# Altium schematic sheet Out.SchDoc: Sheetname
size A4; Date: 05.10.2017; CheckedBy: UNCHECKED; Author: Team Member; Organization: Baltic Racing; Address1: Zur Schwedenschanze 15; Address2: Haus 18; Address3: 18435 Stralsund; Revision: xx.xx; SheetNumber: 8; SheetTotal: 8; Rules: TODO; ProjectName: Projekt
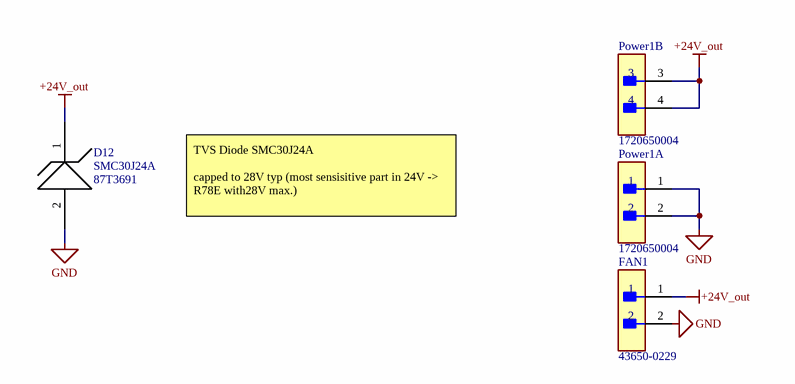
[diagram p0: Out.SchDoc]

## Parts
D12  SMC30J24A  Supplier Part Number 1: 87T3691  [JEDEC DO-214AB]
FAN1  43650-0229  [FP-43650-0229-MFG]
Power1  1720650004  [FP-1720650004-MFG]  (parts A,B of 2)

## Nets
+24V_out: D12.1 FAN1.1 Power1.3 Power1.4
GND: D12.2 FAN1.2 Power1.1 Power1.2

## Notes on the sheet
- TVS Diode SMC30J24A
  capped to 28V typ (most sensisitive part in 24V -> R78E with28V max.)
- Title:
- Projekt:
- Revision:
- Author:
- Rules:
- Checked by:
- Sheet
- of
- Size:
- A4
- Date:
- Time:

## Library data of the parts
D12 = SMC30J24A: 3000 W TVS in SMC package; Manufacturer: STMicroelectronics; Direction: Unidirectional; Number of Unidirectional Channels: 1; Reverse Standoff Voltage: 24V; Min Breakdown Voltage: 26.7V; Clamping Voltage: 38.9V; Peak Pulse Power: 3kW; Power Line Protection: No; Peak Pulse Current: 77A; Diode Type: ZENER; Supplier 1: Newark; Manufacturer Part Number: SMC30J24A; RoHS: Yes; Category: Diodes; Pricing 1: 2500=0,61100 (USD); Mount: Surface Mount; Case/Package: SMC; Number of Pins: 2; Min Operating Temperature: -55°C; Max Operating Temperature: 175°C; Packaging: Tape and Reel; Package Quantity: 2500; Polarity: Unidirectional; Working Voltage: 24V; Max Power Dissipation: 3kW; Breakdown Voltage: 26.7V; Resistor Type: Zener; Series: SMC30J, TRANSIL™; Radiation Hardening: No; REACH SVHC: No SVHC; Lead Free: Lead Free; RoHS Compliant: Yes; ComponentLink1URL: https://datasheet.ciiva.com/339/dm00035134-339433.pdf?src-supplier=Digi-Key; ComponentLink1Description: https://datasheet.ciiva.com/339/dm00035134-339433.pdf?src-supplier=Digi-Key; ComponentLink2URL: https://datasheet.ciiva.com/339/dm00035134-339434.pdf?src-supplier=Digi-Key; ComponentLink2Description: https://datasheet.ciiva.com/339/dm00035134-339434.pdf?src-supplier=Digi-Key; ComponentLink3URL: https://datasheet.ciiva.com/339/dm00035134-339435.pdf?src-supplier=Digi-Key; ComponentLink3Description: https://datasheet.ciiva.com/339/dm00035134-339435.pdf?src-supplier=Digi-Key
FAN1 = CMP-04776-000041-1: CONN HEADER VERT 2POS 3MM; Manufacturer: Molex; Voltage Rating: 600V; Conn Orientation: Vertical; Conn Gender: Male; Number Of Contacts: 2; Current Rating: 8.5A; ComponentLink2URL: https://www.molex.com/webdocs/datasheets/pdf/en-us/0436500229_PCB_HEADERS.pdf; ComponentLink2Description: Datasheet; Mouser Description: Headers & Wire Housings MicroFit 3.0 SR V TH Peg 30Au 2Ckt; Category: Conn; Height: 10.15mm; Contact Material: Gold,Nickel; Octopart: https://octopart.com/43650-0229-molex-7652326; Manufacturer Part Number: 43650-0229; Device Class L3: unset; Digikey Description: CONN HEADER VERT 2POS 3MM; Temperature Range Low: -40°C; Temperature Range High: +105°C; Pitch: 3mm; Package: 0; RoHS: TRUE; Device Class L1: Connectors; Lead Free: Yes; Temperature: -40°C to +105°C; Number Of Rows: 1; Automotive: No; Device Class L2: Headers and Wire Housings; Footprint Url: https://www.molex.com/pdm_docs/sd/436500229_sd.pdf
Power1 = CMP-04776-000102-1: CONN HEADER VERT 4POS 5.7MM; Manufacturer: Molex; Conn Orientation: Vertical; Conn Gender: Male; Voltage Rating: 600V; Number Of Contacts: 4; Current Rating: 23A; Footprint Url: https://www.molex.com/pdm_docs/sd/1720650004_sd.pdf; RoHS: TRUE; Mouser Description: Headers & Wire Housings Mega-Fit Vert Hdr Assy 4 ckt 15u Au; Temperature: -40°C to +120°C; Device Class L3: unset; Temperature Range Low: -40°C; Temperature Range High: +120°C; Device Class L1: Connectors; Lead Free: Yes; Height: 15.05mm; Manufacturer Part Number: 1720650004; ComponentLink2URL: https://www.molex.com/webdocs/datasheets/pdf/en-us/1720650004_PCB_HEADERS.pdf; Number Of Rows: 2; Digikey Description: CONN HEADER VERT 4POS 5.7MM; Octopart: https://octopart.com/172065-0004-molex-34473112; Automotive: No; Category: Conn; ComponentLink2Description: Datasheet; Contact Material: Gold,Nickel; Device Class L2: Headers and Wire Housings; Pitch: 5.7mm; Package: 1720650004